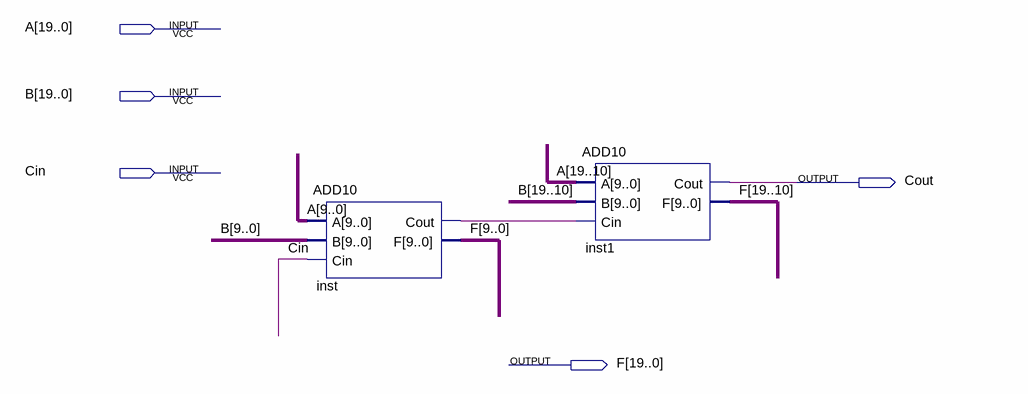
[diagram p0: schematic sheet]
// Quartus schematic ADD20.bdf as structural Verilog: 2 symbols, 5 pins
module ADD20 (
  input  [19:0] A,
  input  [19:0] B,
  input  Cin,
  output Cout,
  output [19:0] F
);

  wire inst_cout;

  ADD10 inst (.A(A[9:0]), .B(B[9:0]), .Cin(Cin), .Cout(inst_cout), .F(F[9:0]));
  ADD10 inst1 (.A(A[19:10]), .B(B[19:10]), .Cin(inst_cout), .Cout(Cout), .F(F[19:10]));
endmodule
